# EAGLE schematic final_schematic  (EAGLE 9.2.0)
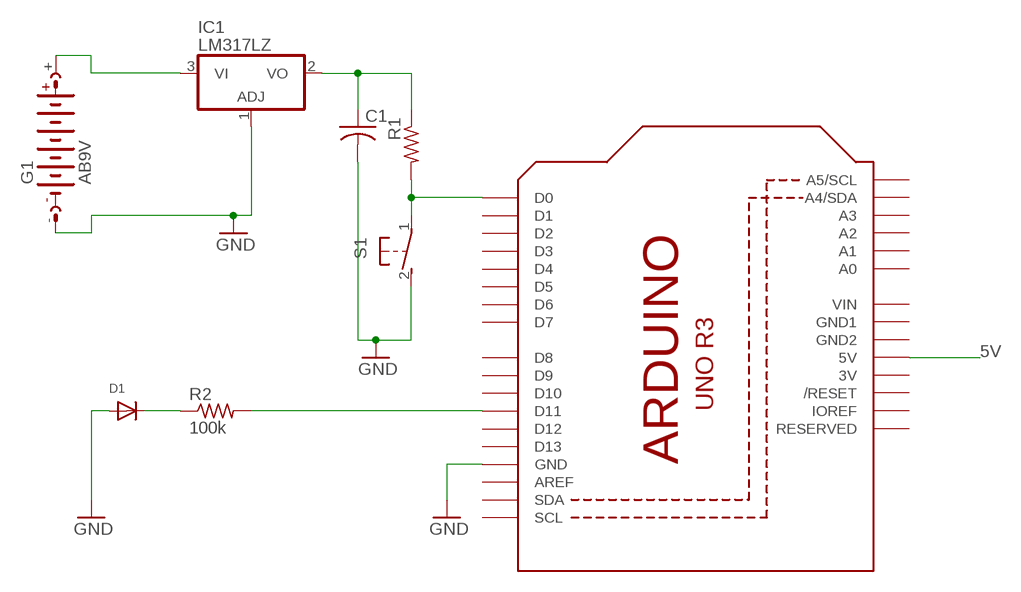
[diagram p0: schematic, sheet 1]

## Parts
C1  C-USC0805  [C0805]
D1  DIODEDO-1N4148  [DO-1N4148]
G1  AB9V  [AB9V]
IC1  LM317LZ  [TO92]
R1  R-US_M0805  [M0805]
R2  100k  R-US_R0805  [R0805]
S1  31-XX  [B3F-31XX]
U1  ARDUINOR3-DIMENSION  [ARDUINOR3]

## Nets
5V: U1.5V
GND: C1.2 D1.A G1.- IC1.1(ADJ) S1.2(S) U1.GND
N$1: G1.+ IC1.3(VI)
N$2: R2.2 U1.D11
N$3: C1.1 IC1.2(VO) R1.1
N$4: R1.2 S1.1(P) U1.D0
N$5: D1.C R2.1
Unconnected: U1.A0 U1.A1 U1.A2 U1.A3 U1.A4(A4/SDA) U1.A5(A5/SCL) U1.AREF U1.D1 U1.D2 U1.D3 U1.D4 U1.D5 U1.D6 U1.D7 U1.D8 U1.D9 U1.D10 U1.D12 U1.D13 U1.IOREF U1.RESERVED U1.RESET(/RESET) U1.SCL U1.SDA

## Power pins joined to a net without a drawn wire
3V: U1.3V
GND1: U1.GND1
GND2: U1.GND2
VIN: U1.VIN

## Library data of the parts
C1 = adafruit:C-US: CAPACITOR, American symbol
D1 = adafruit:DIODE: Diode SMADIODE - SMA Surface Mount Package 20V 1A Schottky Diode Digikey: 641-1014-6-ND DO-1N4148 - Through Hole Small Current Diode SOD-123 20V 1 A (.5mV Vf) Schottky Diode - Digikey: MBRX120TPMSCT-ND SOD-323 10V 570mA (.38mV Vf, 3ns) Schottky Diode - Digikey: ZLLS410CT-ND SOD-523 30V 30mA Schottky Diode (RB751S-40TE61) - Digikey: RB751S-40TE61CT-ND SOT23-R/W - SOT23 Package (R = Solder Paste/Reflow Ovens, W = Hand-Soldering) BAT54Film 40V 300mA - Digikey: 497-7162-1-ND
G1 = battery:AB9V: 9-V BATTERY CLIP
IC1 = linear:*317: Positive VOLTAGE REGULATOR
R1 R2 = adafruit:R-US_: RESISTOR, American symbol
S1 = adafruit:31-XX: OMRON SWITCH Now with beefier pads!
U1 = adafruit:ARDUINOR3: This is a new object for the new Arduino R3 - with extra pins that you may want to use (such as IOref, and duplicated A4/A5

## Net classes
0 default: width 0.305 mm, drill 0.508 mm, clearance 0.305 mm